# Altium schematic sheet stm32.SchDoc
size A4; SheetNumber: 9; SheetTotal: 9
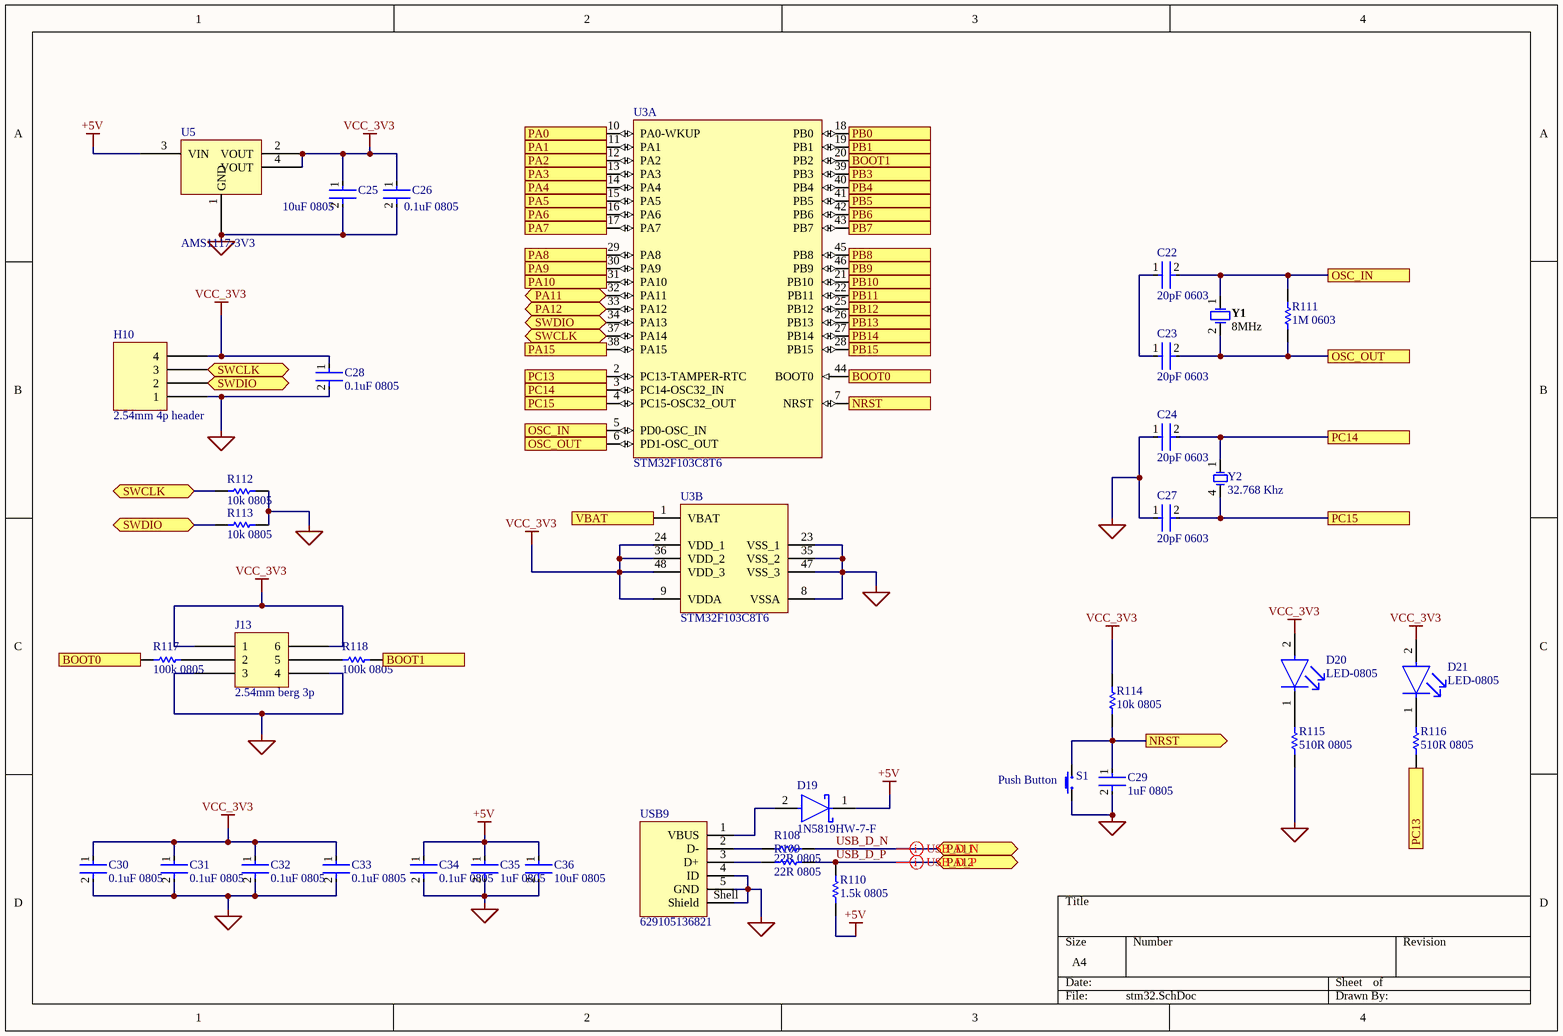
[diagram p0: stm32.SchDoc]

## Parts
C22  20pF 0603  [C0603]
C23  20pF 0603  [C0603]
C24  20pF 0603  [C0603]
C25  10uF 0805  [R0805]
C26  0.1uF 0805  [R0805]
C27  20pF 0603  [C0603]
C28  0.1uF 0805  [R0805]
C29  1uF 0805  [R0805]
C30  0.1uF 0805  [R0805]
C31  0.1uF 0805  [R0805]
C32  0.1uF 0805  [R0805]
C33  0.1uF 0805  [R0805]
C34  0.1uF 0805  [R0805]
C35  1uF 0805  [R0805]
C36  10uF 0805  [R0805]
D19  1N5819HW-7-F  [FP-SOD123-IPC_B]
D20  LED-0805  [LED0805]
D21  LED-0805  [LED0805]
H10  2.54mm 4p header  [2.54mm 4p header]
J13  2.54mm berg 3p  [2.54mm 3p header]
R108  22R 0805  [R0805]
R109  22R 0805  [R0805]
R110  1.5k 0805  [R0805]
R111  1M 0603  [R0603]
R112  10k 0805  [R0805]
R113  10k 0805  [R0805]
R114  10k 0805  [R0805]
R115  510R 0805  [R0805]
R116  510R 0805  [R0805]
R117  100k 0805  [R0805]
R118  100k 0805  [R0805]
S1  Push Button  [PBUTTON]
U3  STM32F103C8T6  [STM-LQFP48_L]  (parts A,B of 2)
U5  AMS1117-3V3  [AMS1117-3V3]
USB9  629105136821  [629105136821]
Y1  8MHz  [FOX-HC49SDLF_V]
Y2  32.768 Khz  [XTAL]

## Ports
BOOT0 (in), BOOT0 (out), BOOT1 (in), BOOT1 (out), NRST (in), NRST (out), OSC_IN, OSC_OUT, PA0, PA1, PA2, PA3, PA4, PA5, PA6, PA7, PA8, PA9, PA10, PA11 (bidir), PA12 (bidir), PA15, PB0, PB1, PB3, PB4, PB5, PB6, PB7, PB8, PB9, PB10, PB11, PB12, PB13, PB14, PB15, PC13 (in), PC13 (out), PC14, PC15, SWCLK (bidir), SWDIO (bidir), VBAT

## Nets
+5V: C34.1 C35.1 C36.1 D19.1(C) R110.1 U5.3(VIN)
GND: C24.1 C25.2 C26.2 C27.1 C28.2 C29.2 C30.2 C31.2 C32.2 C33.2 C34.2 C35.2 C36.2 H10.1 J13.3 J13.4 R112.2 R113.2 R115.1 S1.1 U3.8(VSSA) U3.23(VSS_1) U3.35(VSS_2) U3.47(VSS_3) U5.1(GND) USB9.4(ID) USB9.5(GND) USB9.Shell(Shield)
VCC_3V3: C25.1 C26.1 C28.1 C30.1 C31.1 C32.1 C33.1 D20.2(A) D21.2(A) H10.4 J13.1 J13.6 R114.2 U3.9(VDDA) U3.24(VDD_1) U3.36(VDD_2) U3.48(VDD_3) U5.2(VOUT) U5.4(VOUT)
BOOT0: R117.1 U3.44(BOOT0) ; port BOOT0
BOOT1: R118.2 U3.20(PB2) ; port BOOT1
NRST: C29.1 R114.1 S1.2 U3.7(NRST) ; port NRST
OSC_IN: C22.2 R111.2 U3.5(PD0-OSC_IN) Y1.1 ; port OSC_IN
OSC_OUT: C23.2 R111.1 U3.6(PD1-OSC_OUT) Y1.2 ; port OSC_OUT
PA0: U3.10(PA0-WKUP) ; port PA0
PA1: U3.11(PA1) ; port PA1
PA2: U3.12(PA2) ; port PA2
PA3: U3.13(PA3) ; port PA3
PA4: U3.14(PA4) ; port PA4
PA5: U3.15(PA5) ; port PA5
PA6: U3.16(PA6) ; port PA6
PA7: U3.17(PA7) ; port PA7
PA8: U3.29(PA8) ; port PA8
PA9: U3.30(PA9) ; port PA9
PA10: U3.31(PA10) ; port PA10
PA15: U3.38(PA15) ; port PA15
PB0: U3.18(PB0) ; port PB0
PB1: U3.19(PB1) ; port PB1
PB3: U3.39(PB3) ; port PB3
PB4: U3.40(PB4) ; port PB4
PB5: U3.41(PB5) ; port PB5
PB6: U3.42(PB6) ; port PB6
PB7: U3.43(PB7) ; port PB7
PB8: U3.45(PB8) ; port PB8
PB9: U3.46(PB9) ; port PB9
PB10: U3.21(PB10) ; port PB10
PB11: U3.22(PB11) ; port PB11
PB12: U3.25(PB12) ; port PB12
PB13: U3.26(PB13) ; port PB13
PB14: U3.27(PB14) ; port PB14
PB15: U3.28(PB15) ; port PB15
PC13: R116.1 U3.2(PC13-TAMPER-RTC) ; port PC13
PC14: C24.2 U3.3(PC14-OSC32_IN) Y2.1 ; port PC14
PC15: C27.2 U3.4(PC15-OSC32_OUT) Y2.4 ; port PC15
SWCLK: H10.3 R112.1 U3.37(PA14) ; port SWCLK
SWDIO: H10.2 R113.1 U3.34(PA13) ; port SWDIO
USB_D_N: R108.2 U3.32(PA11) ; port PA11
USB_D_P: R109.2 R110.2 U3.33(PA12) ; port PA12
VBAT: U3.1(VBAT) ; port VBAT
NetC22_1: C22.1 C23.1
NetD19_2: D19.2(A) USB9.1(VBUS)
NetD20_1: D20.1(C) R115.2
NetJ13_2: J13.2 R117.2
NetJ13_5: J13.5 R118.1
NetR108_1: R108.1 USB9.2(D-)
NetR109_1: R109.1 USB9.3(D+)

Not connected (* = marked no-connect by the designer): D21 1(C); R116 2; Y2 2(NC) 3(NC)

## Layout directives
differential pair: USB_D_N, USB_D_P

## Library data of the parts
C22-C24 C27 = 20pF 0603: 20pF/0.02nF 50V Capacitor 5% Tolerance 0603N200J500CT – 0603 Package; Price per piece: 1.85; Product URL: https://sharvielectronics.com/product/20pf-0-02nf-50v-capacitor-5-tolerance-0603n200j500ct-0603-package/; Datasheet: https://drive.google.com/file/d/1bI-gbXJF8P1uj18nKMNUbX5Mw9ANXnPN/view?usp=sharing
C25 C36 = 10uF 0805: 10uF/1000nF 50V Capacitor ±10% Tolerance CC0805KKX5R9BB106 – 0805 Package; Product URL: https://sharvielectronics.com/product/10uf-1000nf-50v-capacitor-%c2%b110-tolerance-cc0805kkx5r9bb106-0805-package/; Price per piece: 2.85; Datasheet: https://drive.google.com/file/d/1wr2K_YaGqgMtACeU2pC6RWLSxDMrIPxr/view?usp=sharing
C26 C28 C30-C34 = 0.1uF 0805: 0.1uF/100nF 100V Capacitor ±10% Tolerance CC0805KKX7R0BB104 – 0805 Package; Product URL: https://sharvielectronics.com/product/0-1uf-100nf-100v-capacitor-%c2%b110-tolerance-cc0805kkx7r0bb104-0805-package/; Price per piece: 4.76; Datasheet: https://drive.google.com/file/d/1wr2K_YaGqgMtACeU2pC6RWLSxDMrIPxr/view?usp=sharing
C29 C35 = 1uF 0805: 1uF/1000nF 50V Capacitor ±10% Tolerance CC0805KKX7R9BB105 – 0805 Package; Price per piece: 2.16; Product URL: https://sharvielectronics.com/product/1uf-1000nf-50v-capacitor-%c2%b110-tolerance-cc0805kkx7r9bb105-0805-package/; Datasheet: https://drive.google.com/file/d/1wr2K_YaGqgMtACeU2pC6RWLSxDMrIPxr/view?usp=sharing
D19 = CMP-0303-00003-3: DIODE SCHOTTKY 40V 1A SOD123; Forward Voltage: 450mV; Capacitance: 110pF; Max Forward Surge Current (Ifsm): 25A; Peak Reverse Current: 50uA; Polarity: Standard; Element Configuration: Single; Max Power Dissipation: 450mW; Min Operating Temperature: -65°C; Package Quantity: 3000; Contact Plating: Tin; Weight: 0.000353oz; Max Repetitive Reverse Voltage (Vrrm): 40V; Max Reverse Voltage (DC): 40V; Height: 1.25mm; Average Rectified Current: 1A; Width: 1.7mm; Case/Package: SOD-123-2; Lead Free: Lead Free; Max Operating Temperature: 125°C; Current Rating: 1A; Termination: SMD/SMT; Forward Current: 1A; Radiation Hardening: No; Number of Pins: 2; Length: 2.85mm; Voltage Rating (DC): 40V; REACH SVHC: No SVHC; Peak Non-Repetitive Surge Current: 25A; Packaging: Tape and Reel; Output Current: 1A; Price per piece: 7.45; Product URL: https://sharvielectronics.com/product/1n5819hw-schottky-diodes-sod-123-package/; Datasheet: https://sharvielectronics.com/wp-content/uploads/2022/02/1N5819HW-Schottky-Diodes-SOD-123-Package.pdf\
D20 = LED-0805: Green LED -0805 SMD Package 17-21/GHC-XS1T2M/3T; Price per piece: 1.85; Product URL: https://sharvielectronics.com/product/green-led-0805-smd-package-17-21-ghc-xs1t2m-3t/; Datasheet: https://everlighteurope.com/index.php?controller=attachment&id_attachment=5819
D21 = LED-0805: Red LED – 0805 SMD Package – 17-21SURC/S530-A3/TR8; Price per piece: 2.32; Product URL: https://sharvielectronics.com/product/red-led-0805-smd-package-17-21surc-s530-a3-tr8/; Datasheet: https://drive.google.com/file/d/193qGY45iPx2JlzACJk7ZLn2axHlG04VY/view?usp=sharing
H10 = 2.54mm 4p header: 1X40 40 Pin Straight Breakaway Male Header 11mm Height Yellow – 2.54mm Pitch; Price per piece: 11.85; Product URL: https://sharvielectronics.com/product/1x40-40-pin-straight-breakaway-male-header-11mm-height-yellow-2-54mm-pitch/; Datasheet: https://sharvielectronics.com/wp-content/uploads/2023/12/2.54mm-Pin-Header-Single-Row-Straight.pdf
J13 = 2.54mm berg 3p: 40×2 Pin Male Berg Strip Break Away Header Right Angle- 2.54mm Pitch; Price per piece: 12.25; Product URL: https://sharvielectronics.com/product/40x2-pin-male-berg-strip-break-away-header-right-angle-2-54mm-pitch/; Datasheet: https://www.mouser.com/catalog/additional/Amphenol_bwb_bergstik.pdf
R108 R109 = R0805: 22 Ohm 1/8 Watt Resistor 1% Tolerance RC0805FR-0722RL – 0805 Package; Price per piece: 0.82; Product URL: https://sharvielectronics.com/product/22-ohm-1-8-watt-resistor-1-tolerance-rc0805fr-0722rl-0805-package/; Datasheet: https://drive.google.com/file/d/1pkLQT_RQ1i35oFQcGREpZr7Oy3Ppi-ZT/view?usp=sharing
R110 = R0805: 1.5K Ohm 1/8 Watt Resistor 1% Tolerance 0805W8F1501T5E – 0805 Package; Price per piece: 0.82; Product URL: https://sharvielectronics.com/product/1-5k-ohm-1-8-watt-resistor-1-tolerance-0805w8f1501t5e-0805-package/; Datasheet: https://drive.google.com/file/d/1rtx85iFJaMrDbsv7PAzG9bTFItPmAE38/view?usp=sharing
R111 = R0603: 1M Ohm 1/10 Watt Resistor 1% Tolerance RC0603FR-071ML – 0603 Package; Price per Piece: 0.87; Product URL: https://sharvielectronics.com/product/1m-ohm-1-10-watt-resistor-1-tolerance-rc0603fr-071ml-0603-package/; Datasheet: https://drive.google.com/file/d/1pkLQT_RQ1i35oFQcGREpZr7Oy3Ppi-ZT/view?usp=sharing
R112-R114 = 10k 0805: 10K Ohm 1/8 Watt Resistor 1% Tolerance RC0805FR-0710KL – 0805 Package; Price per piece: 0.82; Product URL: https://sharvielectronics.com/product/10k-ohm-1-8-watt-resistor-1-tolerance-rc0805fr-0710kl-0805-package/; Datasheet: https://drive.google.com/file/d/1pkLQT_RQ1i35oFQcGREpZr7Oy3Ppi-ZT/view?usp=sharing
R115 R116 = R0805: 510 Ohm 1/8 Watt Resistor 1% Tolerance 0805S8F5100T5E – 0805 Package; Price per piece: 0.85; Product URL: https://sharvielectronics.com/product/510-ohm-1-8-watt-resistor-1-tolerance-0805s8f5100t5e-0805-package/; Datasheet: https://drive.google.com/file/d/1rtx85iFJaMrDbsv7PAzG9bTFItPmAE38/view
R117 R118 = R0805: 100K Ohm 1/8 Watt Resistor 1% Tolerance 0805W8F1003T5E – 0805 Package; Price per piece: 0.89; Product URL: https://sharvielectronics.com/product/100k-ohm-1-8-watt-resistor-1-tolerance-0805w8f1003t5e-0805-package/; Datasheet: https://drive.google.com/file/d/1rtx85iFJaMrDbsv7PAzG9bTFItPmAE38/view?usp=sharing
S1 = PBUTTON: TS36CA-0.6 – 2Pin SPST SMD Right Angle Push Button Switch; Price per piece: 4.52; Product URL: https://sharvielectronics.com/product/ts36ca-0-6-2pin-spst-smd-right-angle-push-button-switch/; Datasheet: https://drive.google.com/file/d/11nXDBprwehBhuTnyyi6cyPbdFHQP9C3O/view?usp=sharing
U3 = CMP-0237-00215-3: STM32F103C8T6 ARM Microcontroller – LQFP-48 Package; Core: ARM Cortex-M3; Supply Voltage(Vcc) min (V): 2; Packing: Tray; Internal RAM Size (kB): 20; FLASH Size (Prog) (kB): 64; A/D Converter: 2x12-bit (10 Channel); I/Os (High Current): 37; Operating Frequency(F) (Processor speed) (MHz): 72; ComponentLink3Description: Package Specification; Mounting Technology: Surface Mount; PartNumber: STM32F103C8T6; PackageReference: LQFP48; ComponentLink3URL: http://www.st.com/st-web-ui/static/active/en/resource/technical/document/datasheet/DM00058181.pdf; DatasheetVersion: Rev. 16; ComponentLink1URL: http://www.st.com/web/en/home.html; PackageVersion: Rev. 6, 06/2013; ComponentLink2URL: http://www.st.com/st-web-ui/static/active/en/resource/technical/document/datasheet/CD00161566.pdf; ComponentLink1Description: Manufacturer URL; ComponentLink2Description: Datasheet; PackageDescription: 48-Pin Low Profile Quad Flat Package, 7 x 7 mm Body, 0.5 mm Pitch; Price per piece: 189.45; Product URL: https://sharvielectronics.com/product/stm32f103c8t6-arm-microcontroller-lqfp-48-package/; Datasheet: https://www.st.com/resource/en/datasheet/stm32f103c8.pdf
U5 = AMS1117-3V3: AMS1117 3.3V – Voltage Regulator IC SMD SOT-223 Package; Price per piece: 6.25; Product URL: https://sharvielectronics.com/product/ams1117-3-3v-voltage-regulator-ic-smd-sot-223-package/; Datasheet: https://sharvielectronics.com/wp-content/uploads/2020/09/AMS1117-3.3V_DS.pdf
USB9 = CMP-1502-03253-2: Micro USB 2.0 B Type Connector 5 Pin SMD; NexarPartId: 19991173; Insulation Resistance: 1GΩ; Contact Resistance: 30mΩ; Number of Contacts: 5; Number of Ports: 1; Gender: Receptacle; Current Rating: 1A; Voltage Rating: 30V; USB Standard: USB 2.0; Plating: Nickel; Max Operating Temperature: 105°C; Orientation: Horizontal; Height: 2.9mm; Termination: Solder; Min Operating Temperature: -40°C; Number of Pins: 5; Flammability Rating: UL94 V-0; Lead Free: Lead Free; Packaging: Tape and Reel; Contact Plating: Gold; RoHS: Compliant; Connector Type: USB; Mount: Horizontal, Surface Mount; Color: Black; REACH SVHC: Unknown; Operating Supply Voltage: 30V; Contact Material: Copper; Number of Positions: 5; Length: 5.9mm; Price per piece: 12.45; Product URL: https://sharvielectronics.com/product/micro-usb-2-0-b-type-connector-5-pin-smd/; Datasheet: https://sharvielectronics.com/wp-content/uploads/2020/06/Micro-USB-2.0-B-type-5-Pin-Connector.pdf
Y1 = CMP-2100-03639-1: HC-49SMD 8MHz Surface Mount Crystal 20PF Oscillator – X49SM8MSD2SC; Manufacturer: FOX Electronics; Series Resistance: 80Ohm; Tolerance: 50ppm; Frequency Tolerance: 30ppm; Datasheet URL: http://www.foxonline.com/pdfs/hc49sdlf.pdf; Package Reference: HC49SDLF; Height: 4.5mm; Mount: SurfaceMount; Packaging: TapeandReel; Length: 11.7mm; Termination: SMD/SMT; Number of Pins: 2; Depth: 5mm; Frequency: 8MHz; Min Operating Temperature: -20degC; Package Quantity: 1000; Load Capacitance: 20pF; RoHSCompliant: True; Lead Free: LeadFree; Width: 5mm; Case/Package: SMD/SMT; Manufacturer URL: http://www.foxonline.com/; Max Operating Temperature: 70degC; REACH SVHC: NoSVHC; Datasheet Version: 42064.0; Package Description: 2-Pin Surface Mount Device, Body 5 x 11.7 mm; Frequency Stability: 50ppm; ESR (Equivalent Series Resistance): 80Ohm; Radiation Hardening: No; Price per piece: 9.5; Product URL: https://sharvielectronics.com/product/hc-49smd-8mhz-surface-mount-crystal-20pf-oscillator-x49sm8msd2sc/; Datasheet: *
Y2 = 32.768 Khz: YSX306GA 32.768 Khz SMD Crystal; Price per piece: 28.69; Product URL: https://sharvielectronics.com/product/ysx306ga-32-768-khz-smd-crystal/; Datasheet: https://drive.google.com/file/d/15lCHrTLPlPWCqCXLaHcSvA8fcw05laDJ/view?usp=sharing